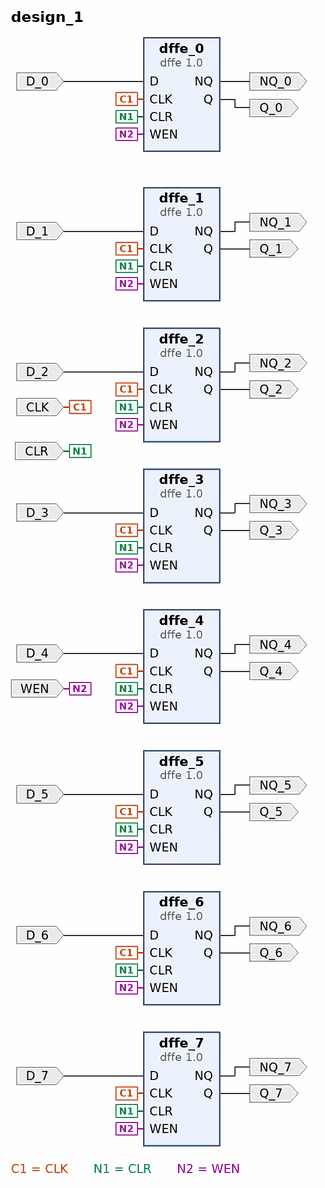
[diagram p0: block diagram of the top level]
# Vivado block design design_1, xc7a100tfgg484-1, Vivado 2017.4
create_bd_design design_1

create_bd_port -dir I -type clk CLK
create_bd_port -dir I CLR
create_bd_port -dir I D_0
create_bd_port -dir O NQ_0
create_bd_port -dir O Q_0
create_bd_port -dir I WEN
create_bd_port -dir I D_1
create_bd_port -dir O NQ_1
create_bd_port -dir O Q_1
create_bd_port -dir I D_2
create_bd_port -dir O NQ_2
create_bd_port -dir O Q_2
create_bd_port -dir I D_3
create_bd_port -dir O NQ_3
create_bd_port -dir O Q_3
create_bd_port -dir I D_4
create_bd_port -dir O NQ_4
create_bd_port -dir O Q_4
create_bd_port -dir I D_5
create_bd_port -dir O NQ_5
create_bd_port -dir O Q_5
create_bd_port -dir I D_6
create_bd_port -dir O NQ_6
create_bd_port -dir O Q_6
create_bd_port -dir I D_7
create_bd_port -dir O NQ_7
create_bd_port -dir O Q_7

create_bd_cell -type ip -vlnv xilinx.com:user:dffe:1.0 dffe_0
create_bd_cell -type ip -vlnv xilinx.com:user:dffe:1.0 dffe_1
create_bd_cell -type ip -vlnv xilinx.com:user:dffe:1.0 dffe_2
create_bd_cell -type ip -vlnv xilinx.com:user:dffe:1.0 dffe_3
create_bd_cell -type ip -vlnv xilinx.com:user:dffe:1.0 dffe_4
create_bd_cell -type ip -vlnv xilinx.com:user:dffe:1.0 dffe_5
create_bd_cell -type ip -vlnv xilinx.com:user:dffe:1.0 dffe_6
create_bd_cell -type ip -vlnv xilinx.com:user:dffe:1.0 dffe_7

# ---- connections ----

connect_bd_net -net CLK_0_1 [get_bd_ports CLK] \
  [get_bd_pins dffe_0/CLK] [get_bd_pins dffe_7/CLK] [get_bd_pins dffe_1/CLK] [get_bd_pins dffe_2/CLK] \
  [get_bd_pins dffe_3/CLK] [get_bd_pins dffe_4/CLK] [get_bd_pins dffe_5/CLK] [get_bd_pins dffe_6/CLK]
connect_bd_net -net CLR_0_1 [get_bd_ports CLR] \
  [get_bd_pins dffe_0/CLR] [get_bd_pins dffe_1/CLR] [get_bd_pins dffe_2/CLR] [get_bd_pins dffe_3/CLR] \
  [get_bd_pins dffe_4/CLR] [get_bd_pins dffe_5/CLR] [get_bd_pins dffe_6/CLR] [get_bd_pins dffe_7/CLR]
connect_bd_net -net D_0_1 [get_bd_ports D_0] [get_bd_pins dffe_0/D]
connect_bd_net [get_bd_pins dffe_0/NQ] [get_bd_ports NQ_0]
connect_bd_net [get_bd_pins dffe_0/Q] [get_bd_ports Q_0]
connect_bd_net -net WEN_0_1 [get_bd_ports WEN] \
  [get_bd_pins dffe_0/WEN] [get_bd_pins dffe_1/WEN] [get_bd_pins dffe_2/WEN] [get_bd_pins dffe_3/WEN] \
  [get_bd_pins dffe_4/WEN] [get_bd_pins dffe_5/WEN] [get_bd_pins dffe_6/WEN] [get_bd_pins dffe_7/WEN]
connect_bd_net -net D_1_1 [get_bd_ports D_1] [get_bd_pins dffe_1/D]
connect_bd_net [get_bd_pins dffe_1/NQ] [get_bd_ports NQ_1]
connect_bd_net [get_bd_pins dffe_1/Q] [get_bd_ports Q_1]
connect_bd_net -net D_2_1 [get_bd_ports D_2] [get_bd_pins dffe_2/D]
connect_bd_net [get_bd_pins dffe_2/NQ] [get_bd_ports NQ_2]
connect_bd_net [get_bd_pins dffe_2/Q] [get_bd_ports Q_2]
connect_bd_net -net D_3_1 [get_bd_ports D_3] [get_bd_pins dffe_3/D]
connect_bd_net [get_bd_pins dffe_3/NQ] [get_bd_ports NQ_3]
connect_bd_net [get_bd_pins dffe_3/Q] [get_bd_ports Q_3]
connect_bd_net -net D_4_1 [get_bd_ports D_4] [get_bd_pins dffe_4/D]
connect_bd_net [get_bd_pins dffe_4/NQ] [get_bd_ports NQ_4]
connect_bd_net [get_bd_pins dffe_4/Q] [get_bd_ports Q_4]
connect_bd_net -net D_5_1 [get_bd_ports D_5] [get_bd_pins dffe_5/D]
connect_bd_net [get_bd_pins dffe_5/NQ] [get_bd_ports NQ_5]
connect_bd_net [get_bd_pins dffe_5/Q] [get_bd_ports Q_5]
connect_bd_net -net D_6_1 [get_bd_ports D_6] [get_bd_pins dffe_6/D]
connect_bd_net [get_bd_pins dffe_6/NQ] [get_bd_ports NQ_6]
connect_bd_net [get_bd_pins dffe_6/Q] [get_bd_ports Q_6]
connect_bd_net -net D_7_1 [get_bd_ports D_7] [get_bd_pins dffe_7/D]
connect_bd_net [get_bd_pins dffe_7/NQ] [get_bd_ports NQ_7]
connect_bd_net [get_bd_pins dffe_7/Q] [get_bd_ports Q_7]

validate_bd_design
save_bd_design
